# EAGLE design untitled (EAGLE 9.6.2)
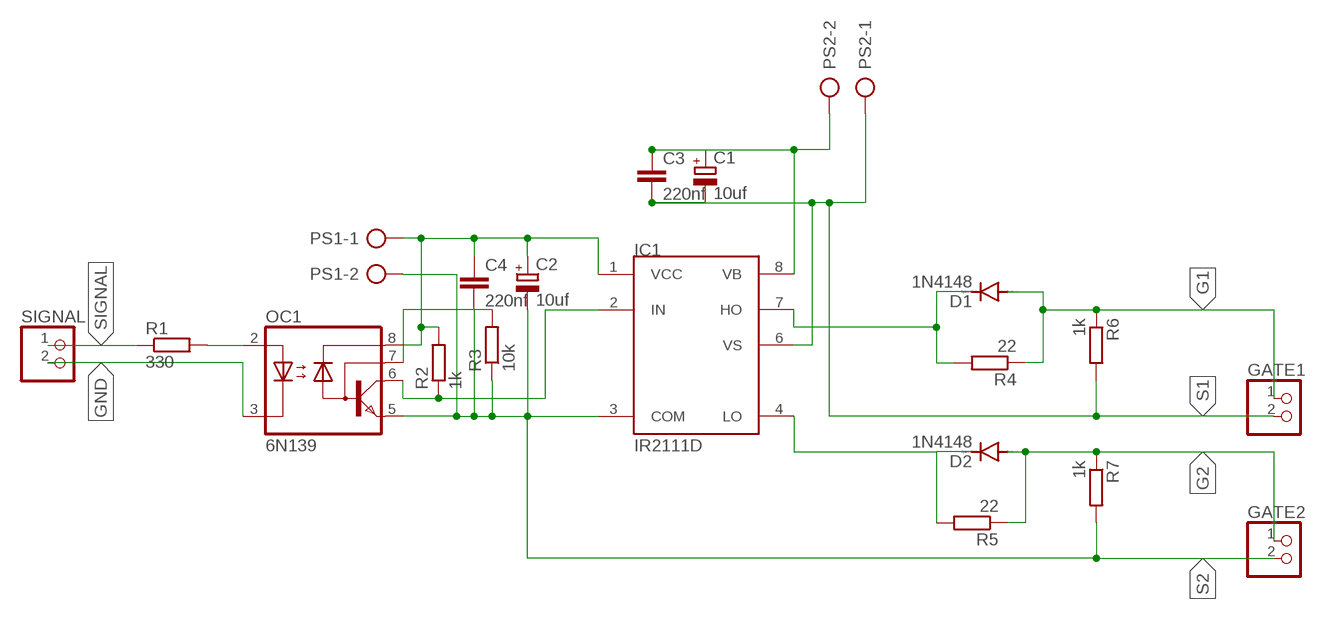
[diagram p0: schematic, sheet 1]

## Parts
C1  10uf  CPOL-EUE2,5-6E  [E2,5-6E]
C2  10uf  CPOL-EUE2,5-6E  [E2,5-6E]
C3  220nf  C-EU025-025X050  [C025-025X050]
C4  220nf  C-EU025-025X050  [C025-025X050]
D1  1N4148  1N4148DO35-10  [DO35-10]
D2  1N4148  1N4148DO35-10  [DO35-10]
GATE1  PINHD-1X2  [1X02]
GATE2  PINHD-1X2  [1X02]
IC1  IR2111D  [DIL08]
OC1  6N139  [DIL08]
PS1  AK300/2  [AK300/2]
PS2  AK300/2  [AK300/2]
R1  330  R-EU_0204/7  [0204/7]
R2  1k  R-EU_0204/7  [0204/7]
R3  10k  R-EU_0204/7  [0204/7]
R4  22  R-EU_0204/7  [0204/7]
R5  22  R-EU_0204/7  [0204/7]
R6  1k  R-EU_0204/7  [0204/7]
R7  1k  R-EU_0204/7  [0204/7]
SIGNAL  PINHD-1X2  [1X02]

## Nets
G1: D1.A GATE1.1 R4.1 R6.1
G2: D2.A GATE2.1 R5.1 R7.1
GND: OC1.3(C) SIGNAL.2
N$2: OC1.2(A) R1.2
N$4: OC1.7(VB) R3.2
N$5: D1.C IC1.7(HO) R4.2
N$6: IC1.2(IN) OC1.6(VO) R2.1
N$9: D2.C IC1.4(LO) R5.2
S1: C1.- C3.2 GATE1.2 IC1.6(VS) PS2.1 R6.2
S2: C2.- C4.2 GATE2.2 IC1.3(COM) OC1.5(GND) PS1.2 R3.1 R7.2
SIGNAL: R1.1 SIGNAL.1
VB: C1.+ C3.1 IC1.8(VB) PS2.2
VCC: C2.+ C4.1 IC1.1(VCC) OC1.8(VCC) PS1.1 R2.2

## Library data of the parts
C1 C2 = rcl:CPOL-EU: POLARIZED CAPACITOR, European symbol; SPICEPREFIX: C
C3 C4 = rcl:C-EU: CAPACITOR, European symbol; SPICEPREFIX: C
D1 D2 = diode:1N4148: DIODE high speed (Philips)
GATE1 GATE2 SIGNAL = pinhead:PINHD-1X2: PIN HEADER
IC1 = irs:IR2111
OC1 = optocoupler:6N139
PS1 PS2 = con-ptr500:AK300/2: CONNECTOR; OC_FARNELL: unknown; OC_NEWARK: unknown
R1-R7 = rcl:R-EU_: RESISTOR, European symbol; SPICEPREFIX: R

## Board
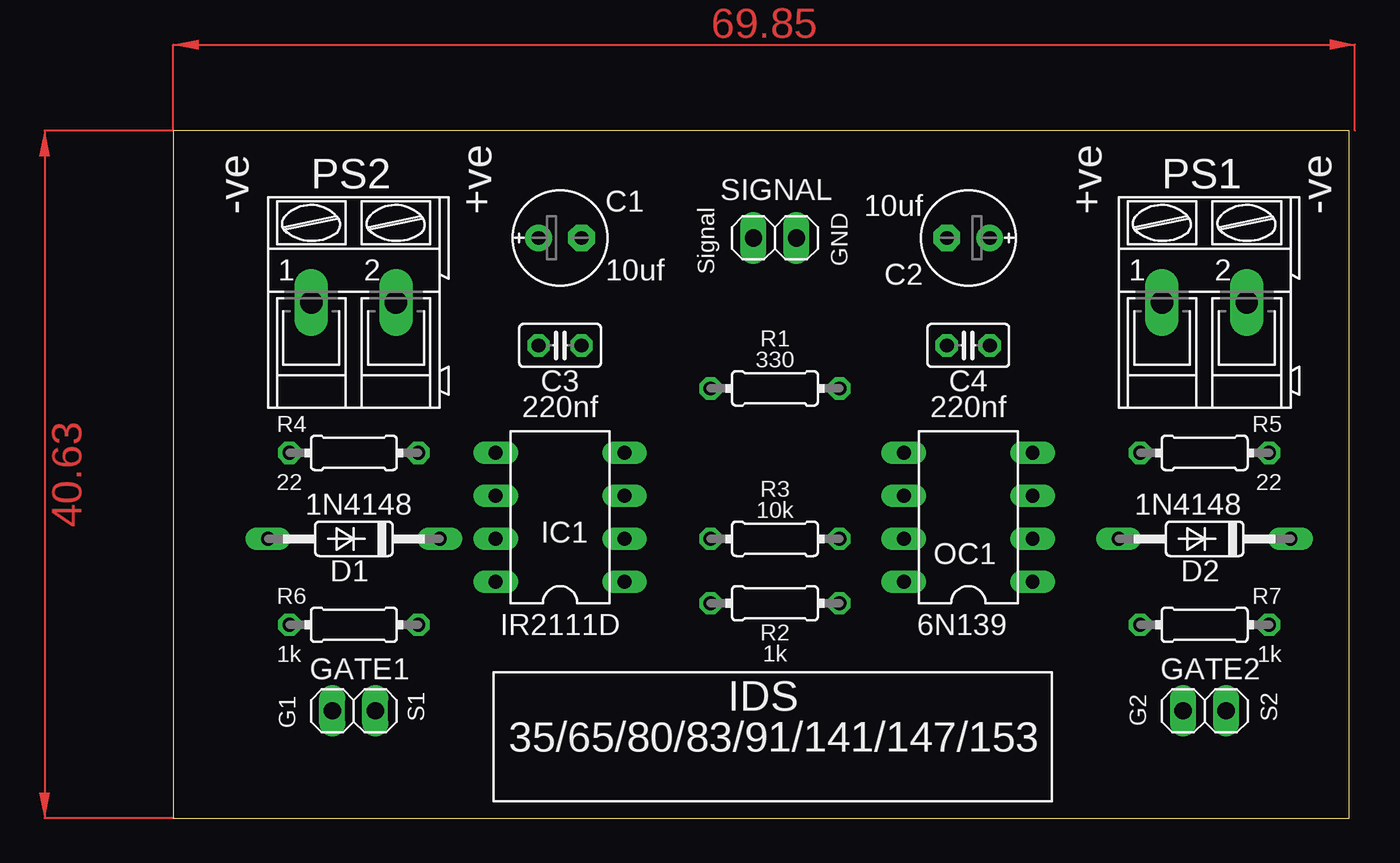
[diagram p1: board, top side]
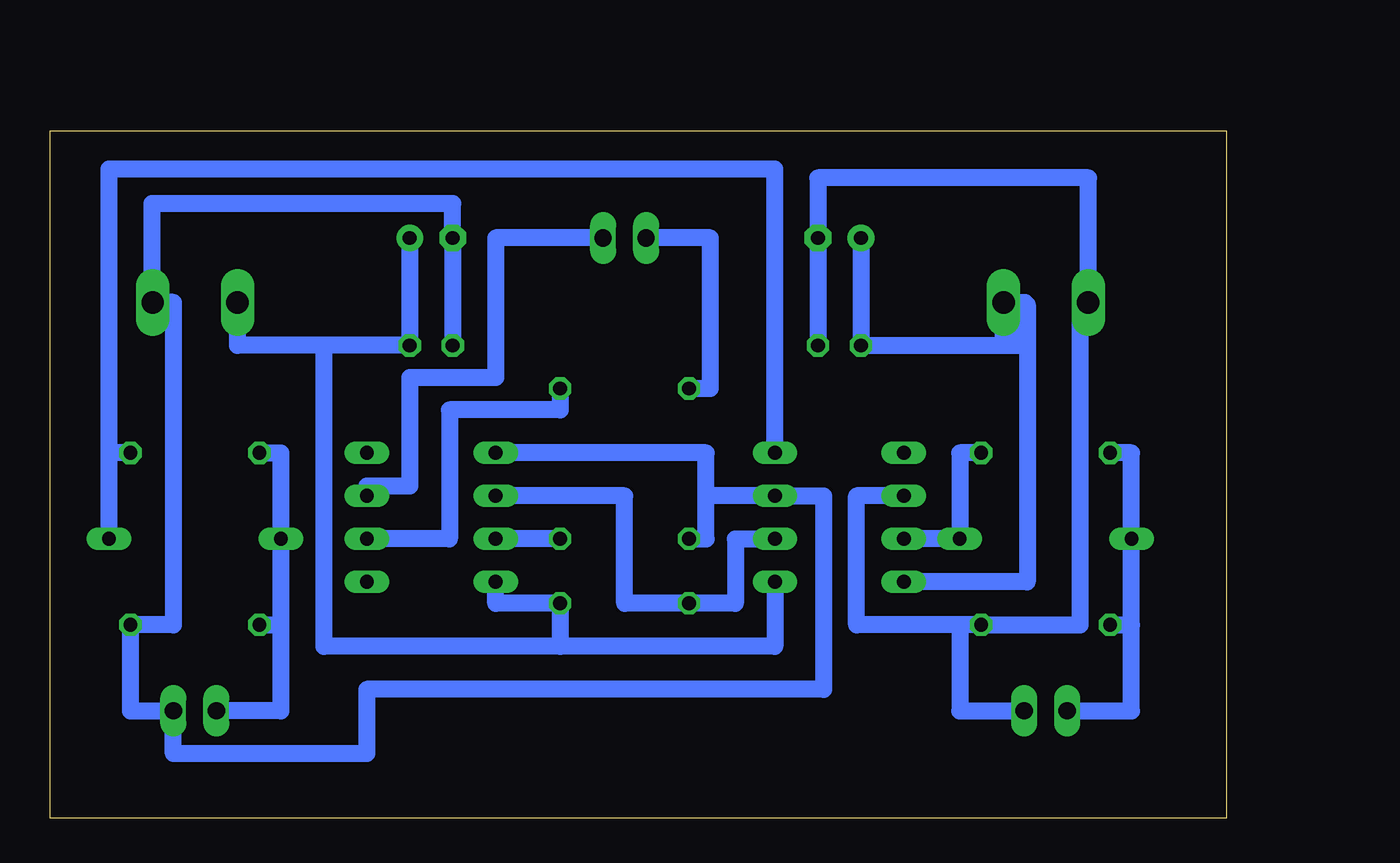
[diagram p2: board, bottom side, seen from below]

Size 69.52 x 40.63 mm. Coordinates in mm from the lower left corner, seen from the top.
Outline: 0,0 69.52,0 69.52,40.63 0,40.63 0,0
Copper layers (1*16): Top 0.035mm / dielectric 1.5mm / Bottom 0.035mm
Design rules "default *": minimum track width 0.7mm, minimum drill 0.35mm, track to track 0.5mm, track to pad 0.5mm, pad to pad 0.5mm, via to via 6mil, smd to smd 6mil, copper to edge 40mil, drill to drill 6mil, minimum pad ring 10mil, minimum via ring 8mil, stop-mask expansion 4mil, vias tented up to drill 0mil, thermal gap 10mil

### Footprints (pad centres in the part's own frame; a part is rotated, then mirrored left to right if it is on the bottom)
E2,5-6E = drill 0.813 pad 1.575: + -1.27,0 | drill 0.813 pad 1.575 octagon: - 1.27,0
C025-025X050 = drill 0.813 octagon: 1 -1.27,0; 2 1.27,0
DO35-10 = drill 0.813 long: A 5.08,0; C -5.08,0
1X02 = drill 1.016 long: 1 -1.27,0; 2 1.27,0
DIL08 = drill 0.813 long: 1 -3.81,-3.81; 2 -1.27,-3.81; 3 1.27,-3.81; 4 3.81,-3.81; 5 3.81,3.81; 6 1.27,3.81; 7 -1.27,3.81; 8 -3.81,3.81
AK300/2 = drill 1.321 long: 1 -2.515,0; 2 2.489,0
0204/7 = drill 0.813 octagon: 1 -3.81,0; 2 3.81,0

### Placement (x,y rotation side)
C1  22.86,34.29 0 top
C2  46.99,34.29 180 top
C3  22.86,27.94 0 top
C4  46.99,27.94 180 top
D1  10.67,16.51 180 top
D2  60.96,16.51 180 top
GATE1  10.67,6.35 0 top
GATE2  60.96,6.35 0 top
IC1  22.86,17.78 90 top
OC1  46.99,17.78 90 top
PS1  60.96,30.48 0 top
PS2  10.67,30.48 0 top
R1  35.56,25.4 0 top
R2  35.56,12.7 0 top
R3  35.56,16.51 0 top
R4  10.67,21.59 0 top
R5  60.96,21.59 0 top
R6  10.67,11.43 0 top
R7  60.96,11.43 0 top
SIGNAL  35.56,34.29 0 top

### Tracks (layer width: path | path; a pad name or v marks a point on that pad's centre or on a via)
G1
  Bottom 1: D1.A 5.08,16.51 | 5.59,11.43 5.59,6.35 GATE1.1 | 5.59,11.43 D1.A | D1.A 5.59,21.59 R4.1 | R6.1 5.59,11.43
G2
  Bottom 1: GATE2.1 55.88,6.35 55.88,11.43 | R5.1 55.88,21.59 D2.A 55.88,11.43 | R7.1 55.88,11.43
GND
  Bottom 1: SIGNAL.2 43.18,34.29 43.18,26.03 48.26,26.03 48.26,19.63 50.8,19.63 OC1.3
N$2
  Bottom 1: OC1.2 45.9,16.51 45.9,24.13 39.37,24.13 R1.2
N$4
  Bottom 1: R3.2 OC1.7
N$5
  Bottom 1: IC1.7 D1.C 15.75,21.59 R4.2
N$6
  Bottom 1: OC1.6 35.56,19.05 35.56,12.7 R2.1 29.01,12.7 29.01,16.51 IC1.2
N$9
  Bottom 1: IC1.4 26.67,38.35 66.04,38.35 66.04,21.59 | 66.04,21.59 D2.C | R5.2 66.04,21.59
S1
  Bottom 1: GATE1.2 15.75,6.35 15.75,11.43 R6.2 | C3.2 C1.- 24.13,37.84 8.13,37.84 8.13,30.48 PS2.1 8.64,30 8.64,11.43 R6.2 | IC1.6 21.84,19.05 21.84,11.43 R6.2
S2
  Bottom 1: C4.2 C2.- 45.72,36.32 63.5,36.32 63.5,30.48 PS1.2 62.23,30.48 62.23,11.43 R7.2 64.77,6.35 GATE2.2 62.23,3.81 50.8,3.81 50.8,7.62 23.8,7.62 23.8,19.05 IC1.3 30.73,19.05 | OC1.5 30.73,21.59 30.73,19.05 | R3.1 30.73,16.51 30.73,19.05
SIGNAL
  Bottom 1: SIGNAL.1 30.48,34.29 30.48,25.4 R1.1
VB
  Bottom 1: C1.+ C3.1 13.16,27.94 | 13.16,27.94 PS2.2 12.7,30.48 | 12.7,30.48 11.89,30.48 11.75,30.35 11.75,27.94 | 11.75,27.94 11.75,13.97 IC1.8 | 13.16,27.94 12.7,27.94 | 12.7,27.94 12.7,30.48 | 12.7,27.94 11.75,27.94
VCC
  Bottom 1: C2.+ C4.1 53.34,27.94 | PS1.1 58.45,27.94 53.34,27.94 | IC1.1 26.67,10.16 39.37,10.16 | 39.37,10.16 53.34,10.16 53.34,27.94 | OC1.8 43.18,12.7 R2.2 39.37,10.16
(copper drawn outside any net)
  shapes: Top area x2

### Text on the board
tNames: -ve | +ve | +ve | -ve | Signal | GND | IDS | G1 | S1 | G2 | S2 | 35/65/80/83/91/141/147/153